# Altium project PCB_Project.PrjPcb
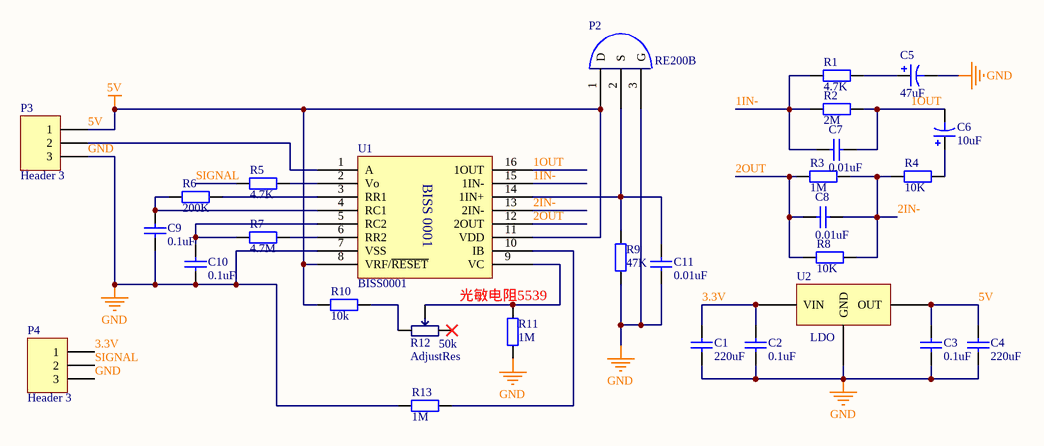
[diagram p0: Sheet2.SchDoc]
1 sheet, 29 parts. Net scope: global (net labels, ports and power ports of the same name join across sheets).
Board file: PCB2.PcbDoc

## Sheet Sheet2.SchDoc
size A4

### Parts
C1  value 220uF  [8*12]  (hidden comment: Cap)
C2  value 0.1uF  [0603]  (hidden comment: Cap)
C3  value 0.1uF  [0603]  (hidden comment: Cap)
C4  value 220uF  [8*12]  (hidden comment: Cap)
C5  value 47uF  [1210]  (hidden comment: Cap Pol1)
C6  value 10uF  [1206]  (hidden comment: Cap Pol1)
C7  value 0.01uF  [0603]  (hidden comment: Cap)
C8  value 0.01uF  [0603]  (hidden comment: Cap)
C9  value 0.1uF  [0603]  (hidden comment: Cap)
C10  value 0.1uF  [0603]  (hidden comment: Cap)
C11  value 0.01uF  [0603]  (hidden comment: Cap)
P2  RE200B  [RE200B]
P3  Header 3  [HDR1X3]
P4  Header 3  [HDR1X3]
R1  value 4.7K  [0603]  (hidden comment: Res2)
R2  value 2M  [0603]  (hidden comment: Res2)
R3  value 1M  [0603]  (hidden comment: Res2)
R4  value 10K  [0603]  (hidden comment: Res2)
R5  value 4.7K  [0603]  (hidden comment: Res2)
R6  value 200K  [0603]  (hidden comment: Res2)
R7  value 4.7M  [0603]  (hidden comment: Res2)
R8  value 10K  [0603]  (hidden comment: Res2)
R9  value 47K  [0603]  (hidden comment: Res2)
R10  value 10k  [0603]  (hidden comment: Res2)
R11  value 1M  [photoresistor5539]  (hidden comment: Res2)
R12  AdjustRes  [RM063-503]
R13  value 1M  [0603]  (hidden comment: Res2)
U1  BISS0001  [BISS0001]
U2  LDO  [SOT-89-3]

### Nets
5V: C3.1 C4.1 P2.1(D) P3.1 R10.1 U1.8(VRF/~{RESET}) U1.11(VDD) U2.3(OUT)
GND: C1.2 C2.2 C3.2 C4.2 C5.2 C9.2 C10.2 C11.1 P2.3(G) P3.3 P4.3 R9.1 R11.1 R13.1 U1.7(VSS) U2.1(GND)
1IN-: C7.2 R1.2 R2.2 U1.15(1IN-)
1OUT: C6.2 C7.1 R2.1 U1.16(1OUT)
2IN-: C8.1 R3.1 R4.2 R8.1 U1.13(2IN-)
2OUT: C8.2 R3.2 R8.2 U1.12(2OUT)
3.3V: C1.1 C2.1 P4.1 U2.2(VIN)
SIGNAL: P4.2 R5.1
NetC5_1: C5.1 R1.1
NetC6_1: C6.1 R4.1
NetC9_1: C9.1 R6.1 U1.4(RC1)
NetC10_1: C10.1 R7.1 U1.5(RC2)
NetC11_2: C11.2 P2.2(S) R9.2 U1.14(1IN+)
NetP3_2: P3.2 U1.1(A)
NetR5_2: R5.2 U1.2(Vo)
NetR6_2: R6.2 U1.3(RR1)
NetR7_2: R7.2 U1.6(RR2)
NetR10_2: R10.2 R12.1
NetR11_2: R11.2 R12.2 U1.9(VC)
NetR13_2: R13.2 U1.10(IB)

Not connected (* = marked no-connect by the designer): R12 3*

### Notes on the sheet
- 光敏电阻5539
- (in symbol BISS0001) BISS 0001
- (in symbol RM063-503) 50k

### Library data of the parts
C1-C4 C7-C11 = Cap: Capacitor; Published: 8-Jun-2000; LatestRevisionDate: 17-Jul-2002; LatestRevisionNote: Re-released for DXP Platform.; PackageReference: RAD-0.3; Publisher: Altium Limited; PackageDescription: Radial Cap, Thru-Hole; 2 Leads; 0.3 in Pin Spacing
C5 C6 = Cap Pol1: Polarized Capacitor (Radial); Published: 8-Jun-2000; LatestRevisionDate: 17-Jul-2002; LatestRevisionNote: Re-released for DXP Platform.; PackageReference: RB7.6-15; Publisher: Altium Limited; PackageDescription: Polarized Capacitor (Radial); 2 Leads
P2 = RE200B: Infrared Sensor
P3 P4 = Header 3: Header, 3-Pin; LatestRevisionDate: 17-Jul-2002; LatestRevisionNote: Re-released for DXP Platform.; Publisher: Altium Limited
R1-R11 R13 = Res2: Resistor; Published: 8-Jun-2000; LatestRevisionDate: 17-Jul-2002; LatestRevisionNote: Re-released for DXP Platform.; PackageReference: AXIAL-0.4; Publisher: Altium Limited; PackageDescription: Axial Device, Thru-Hole; 2 Leads; 0.4 in Pin Spacing
R12 = RM063-503
U1 = BISS0001: Infrared Sensor
U2 = SE8550: +1V~35V >5V